# Altium schematic sheet CAN.SchDoc
size A4; SheetNumber: 3; SheetTotal: 3
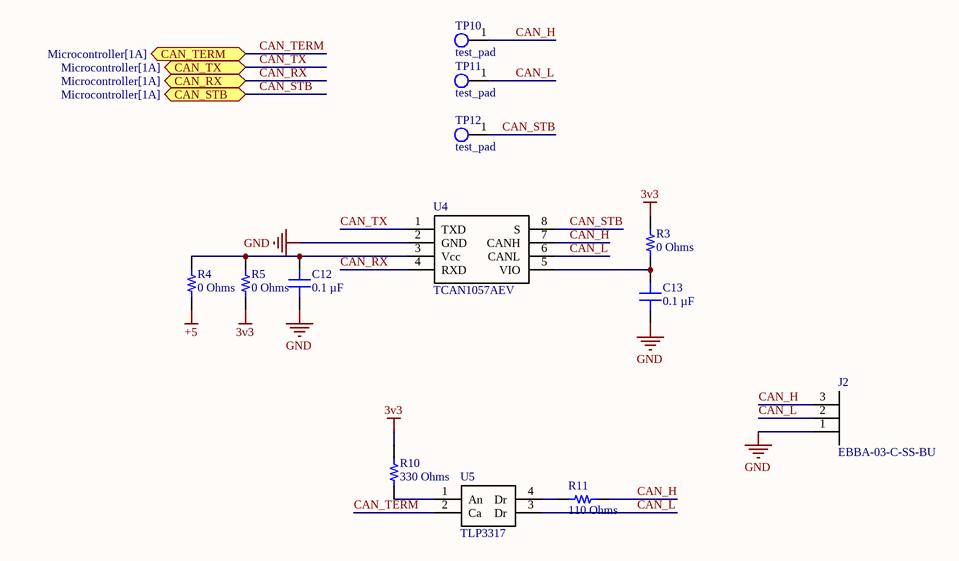
[diagram p0: CAN.SchDoc]

## Parts
C12  0.1 µF  [CAP 0603_1608]
C13  0.1 µF  [CAP 0603_1608]
J2  EBBA-03-C-SS-BU  [EBBA-03-C-SS-BU]
R3  0 Ohms  [RES 0603_1608]
R4  0 Ohms  [RES 0603_1608]
R5  0 Ohms  [RES 0603_1608]
R10  330 Ohms  [RES 0603_1608]
R11  110 Ohms  [RES 0603_1608]
TP10  test_pad  [2mm TP]
TP11  test_pad  [2mm TP]
TP12  test_pad  [2mm TP]
U4  TCAN1057AEV  [TCAN1057AEV]
U5  TLP3317  [TLP3317]

## Ports
CAN_RX (bidir, see Microcontroller[1A]), CAN_STB (bidir, see Microcontroller[1A]), CAN_TERM (bidir, see Microcontroller[1A]), CAN_TX (bidir, see Microcontroller[1A])

## Nets
3v3: R3.2 R5.1 R10.2
+5: R4.1
GND: C12.1 C13.1 J2.1 U4.2(GND)
CAN_H: J2.3 R11.1 TP10.1 U4.7(CANH)
CAN_L: J2.2 TP11.1 U4.6(CANL) U5.3(Dr)
CAN_RX: U4.4(RXD) ; port CAN_RX
CAN_STB: TP12.1 U4.8(S) ; port CAN_STB
CAN_TERM: U5.2(Ca) ; port CAN_TERM
CAN_TX: U4.1(TXD) ; port CAN_TX
NetC12_2: C12.2 R4.2 R5.2 U4.3(Vcc)
NetC13_2: C13.2 R3.1 U4.5(VIO)
NetR10_1: R10.1 U5.1(An)
NetR11_2: R11.2 U5.4(Dr)

## Library data of the parts
C12 C13 = CL10B104KB8NNNC: CAP CER 0.1UF 50V X7R 0603; manufacturer: Samsung Electro-Mechanics; Tolerance: ±10%; Part Number: CL10B104KB8NNNC; Value: 0.1 µF; Applications: General Purpose; Capacitance: 0.1 µF; componentlink1description: Datasheet; componentlink1url: http://www.samsungsem.com/kr/support/product-search/mlcc/CL10B104KB8NNNC.jsp; componentlink2description: DigiKey Link; componentlink2url: https://www.digikey.com/en/products/detail/samsung-electro-mechanics/CL10B104KB8NNNC/3886658; Device Package: 0603 (1608 Metric); lastupdated: 2023-11-08 8:08:57 PM; Lifecycle Status: Active; Minimum Order: 1; Mounting Type: Surface Mount, MLCC; Operating Temperature: -55°C ~ 125°C; Package / Case: 0603 (1608 Metric); packaging: TapeAndReel; partid: 9788; Part Status: Active; price: 0.01; series: CL; Size / Dimension: 0.063" L x 0.031" W (1.60mm x 0.80mm); Supplier 1: DigiKey; Supplier Part Number 1: 1276-1000-1-ND; Temperature Coefficient: X7R; Thickness (Max): 0.035" (0.90mm); Voltage - Rated: 50V
J2 = EBBA-03-C-SS-BU: Screw Terminal
R3-R5 = RMCF0603ZT0R00: RES 0 OHM JUMPER 1/10W 0603; Manufacturer: Stackpole Electronics Inc; Power (Watts): 0.1W, 1/10W; Part Number: RMCF0603ZT0R00; Value: 0 Ohms; ComponentLink1Description: Datasheet; ComponentLink1URL: https://www.seielect.com/catalog/sei-rmcf_rmcp.pdf; ComponentLink2Description: DigiKey Link; ComponentLink2URL: https://www.digikey.com/en/products/detail/stackpole-electronics-inc/RMCF0603ZT0R00/1756908; Composition: Thick Film; Device Package: 0603 (1608 Metric); Features: Automotive AEC-Q200; Height - Seated (Max): 0.022" (0.55mm); LastUpdated: 2023-11-08 8:34:48 PM; Lifecycle Status: Active; Minimum Order: 1; Number of Terminations: 2; Operating Temperature: -55°C ~ 155°C; Package / Case: 0603 (1608 Metric); Packaging: CutTape; PartId: 22613; Part Status: Active; Price: 0.01; Ratings: AEC-Q200; Resistance: 0 Ohms; Series: RMCF; Size / Dimension: 0.061" L x 0.031" W (1.55mm x 0.80mm); Supplier 1: DigiKey; Supplier Part Number 1: RMCF0603ZT0R00CT-ND; Supplier Device Package: 0603; Tolerance: Jumper
R10 = CR0603-JW-331ELF: RES SMD 330 OHM 5% 1/10W 0603; Manufacturer: Bourns Inc.; Power (Watts): 0.1W, 1/10W; Temperature Coefficient: ±200ppm/°C; Part Number: CR0603-JW-331ELF; Value: 330 Ohms; ComponentLink1Description: Datasheet; ComponentLink1URL: https://www.bourns.com/docs/Product-Datasheets/CHPREZTR.pdf; ComponentLink2Description: DigiKey Link; ComponentLink2URL: https://www.digikey.com/en/products/detail/bourns-inc/CR0603-JW-331ELF/2345095; Composition: Thick Film; Device Package: 0603 (1608 Metric); Features: Moisture Resistant; Height - Seated (Max): 0.022" (0.55mm); LastUpdated: 2023-11-08 8:34:22 PM; Lifecycle Status: Active; Minimum Order: 1; Number of Terminations: 2; Operating Temperature: -55°C ~ 155°C; Package / Case: 0603 (1608 Metric); Packaging: CutTape; PartId: 25660; Part Status: Active; Price: 0.01; Resistance: 330 Ohms; Series: CR0603; Size / Dimension: 0.063" L x 0.031" W (1.60mm x 0.80mm); Supplier 1: DigiKey; Supplier Part Number 1: CR0603-JW-331ELFCT-ND; Supplier Device Package: 0603; Tolerance: ±5%
R11 = RMCF0603FT110R: RES 110 OHM 1% 1/10W 0603; Manufacturer: Stackpole Electronics Inc; Power (Watts): 0.1W, 1/10W; Temperature Coefficient: ±100ppm/°C; Part Number: RMCF0603FT110R; Value: 110 Ohms; ComponentLink1Description: Datasheet; ComponentLink1URL: https://www.seielect.com/catalog/sei-packaging.pdf; ComponentLink2Description: DigiKey Link; ComponentLink2URL: https://www.digikey.com/en/products/detail/stackpole-electronics-inc/RMCF0603FT110R/1761268; Composition: Thick Film; Device Package: 0603 (1608 Metric); Features: Automotive AEC-Q200; Height - Seated (Max): 0.022" (0.55mm); LastUpdated: 2023-11-08 8:35:50 PM; Lifecycle Status: Active; Minimum Order: 1; Number of Terminations: 2; Operating Temperature: -55°C ~ 155°C; Package / Case: 0603 (1608 Metric); Packaging: CutTape; PartId: 6924; Part Status: Active; Price: 0.01; Ratings: AEC-Q200; Resistance: 110 Ohms; Series: RMCF; Size / Dimension: 0.061" L x 0.031" W (1.55mm x 0.80mm); Supplier 1: DigiKey; Supplier Part Number 1: RMCF0603FT110RCT-ND; Supplier Device Package: 0603; Tolerance: ±1%
TP10-TP12 = test_pad: Test pad for ICT